# EAGLE schematic AD5791 (EAGLE 6.6.0)
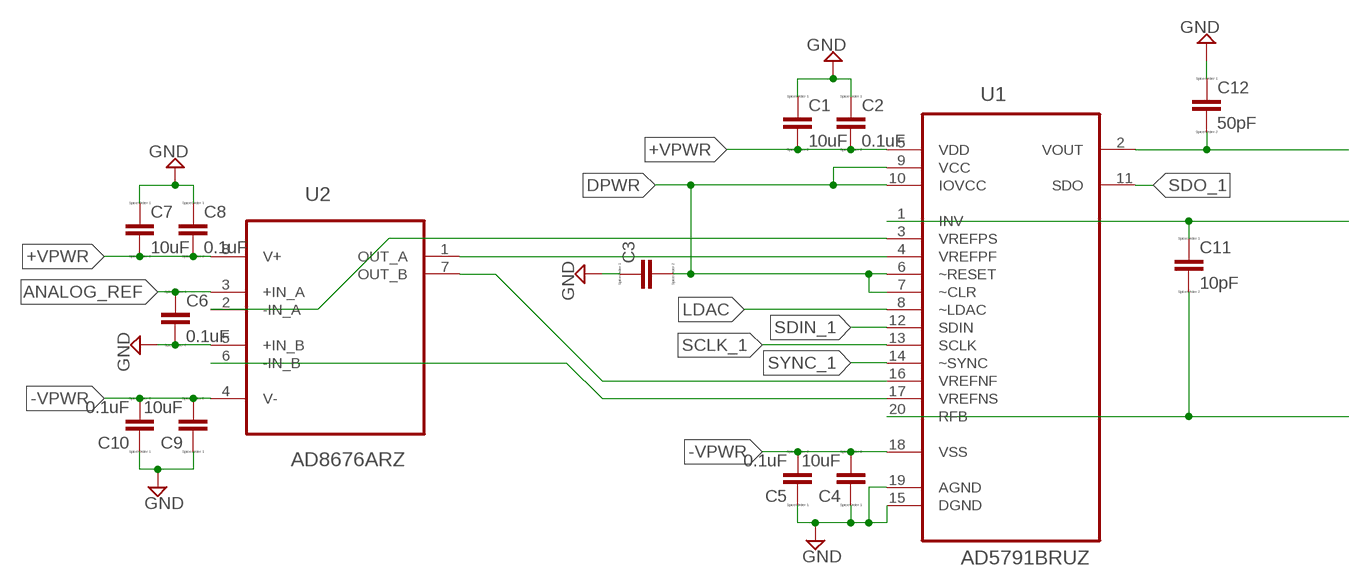
[diagram p0: schematic, sheet 1]

## Parts
C1  10uF  C  [C0805]
C2  0.1uF  CC0603  [C0603]
C3  CC0603  [C0603]
C4  10uF  C  [C0805]
C5  0.1uF  CC0603  [C0603]
C6  0.1uF  CC0603  [C0603]
C7  10uF  C  [C0805]
C8  0.1uF  CC0603  [C0603]
C9  10uF  C  [C0805]
C10  0.1uF  CC0603  [C0603]
C11  10pF  CC0603  [C0603]
C12  50pF  CC0603  [C0603]
U1  AD5791BRUZ  [SOP65P640X120-20N]
U2  AD8676ARZ  [SOIC127P600X175-8N]

## Nets
+VPWR: C1.2 C2.2 C7.2 C8.2 U1.5(VDD) U2.8(V+)
-VPWR: C4.2 C5.2 C9.2 C10.2 U1.18(VSS) U2.4(V-)
ANALOG_REF: C6.1 U2.3(+IN_A)
DPWR: C3.2 U1.6(~RESET) U1.7(~CLR) U1.9(VCC) U1.10(IOVCC)
GND: C1.1 C2.1 C3.1 C4.1 C5.1 C6.2 C7.1 C8.1 C9.1 C10.1 C12.1 U1.15(DGND) U1.19(AGND) U2.5(+IN_B)
LDAC: U1.8(~LDAC)
N$1: U1.4(VREFPF) U2.1(OUT_A)
N$2: U1.16(VREFNF) U2.7(OUT_B)
N$3: U1.3(VREFPS) U2.2(-IN_A)
N$4: U1.17(VREFNS) U2.6(-IN_B)
N$5: C12.2 U1.2(VOUT)
N$6: C11.1 U1.1(INV)
N$7: C11.2 U1.20(RFB)
SCLK_1: U1.13(SCLK)
SDIN_1: U1.12(SDIN)
SDO_1: U1.11(SDO)
SYNC_1: U1.14(~SYNC)

## Library data of the parts
C1-C12 = eagle-ltspice:C: CAPACITOR, European symbol; SPICEMODEL: NONE; SPICEPREFIX: C
U1 = Analog Devices_By_element14_Batch_1:AD5791BRUZ: DAC; MPN: AD5791BRUZ; OC_FARNELL: -; OC_NEWARK: 85R6432; PACKAGE: TSSOP-20; SUPPLIER: Analog Devices
U2 = Analog Devices_By_element14_Batch_1:AD8676ARZ: Ultraprecision, 36 V, 2.8 nV/ãHz Dual Rail-to-Rail Output Op Amp; MPN: AD8676ARZ; OC_FARNELL: 1316453; OC_NEWARK: 28M4146; PACKAGE: SOIC-8; SUPPLIER: Analog Devices